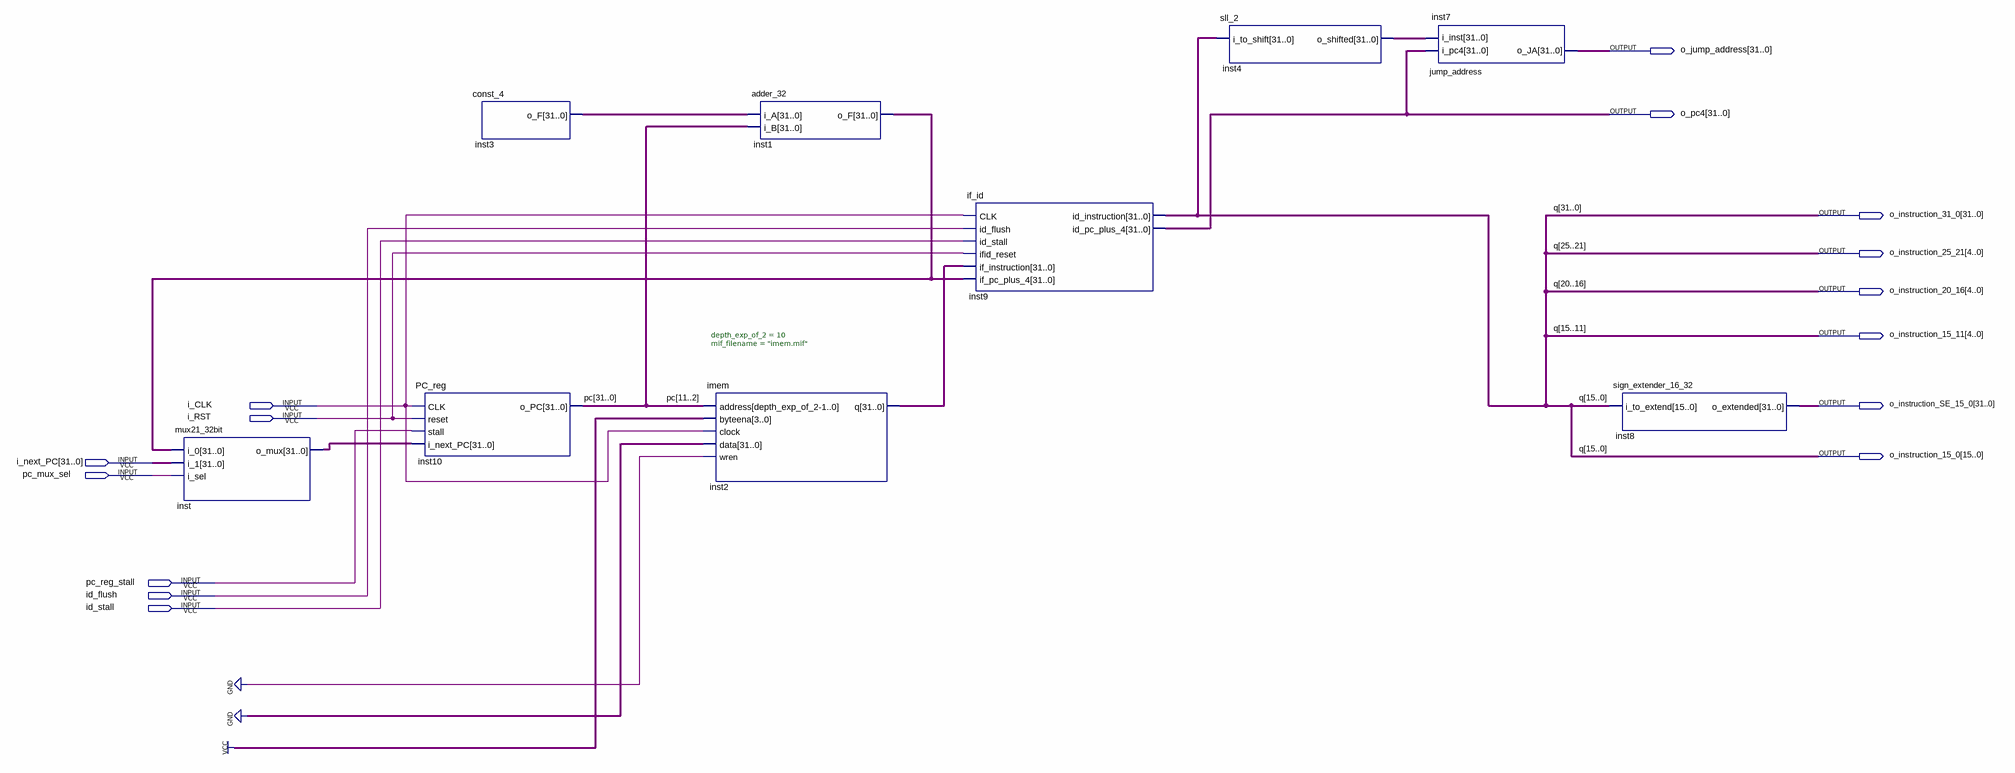
[diagram p0: schematic sheet]
// Quartus schematic instruction_pipe.bdf as structural Verilog: 9 symbols, 15 pins
module instruction_pipe (
  input  i_CLK,
  input  i_RST,
  input  [31:0] i_next_PC,
  input  pc_mux_sel,
  input  pc_reg_stall,
  input  id_flush,
  input  id_stall,
  output [31:0] o_jump_address,
  output [31:0] o_pc4,
  output [31:0] o_instruction_31_0,
  output [4:0] o_instruction_25_21,
  output [4:0] o_instruction_20_16,
  output [4:0] o_instruction_15_11,
  output [31:0] o_instruction_SE_15_0,
  output [15:0] o_instruction_15_0
);

  wire [31:0] inst1_o_f, inst2_q, inst3_o_f, inst4_o_shifted, inst_o_mux, pc;

  mux21_32bit inst (.i_0(inst1_o_f), .i_1(i_next_PC), .i_sel(pc_mux_sel), .o_mux(inst_o_mux));
  PC_reg inst10 (.CLK(i_CLK), .reset(i_RST), .stall(pc_reg_stall), .i_next_PC(inst_o_mux), .o_PC(pc));
  const_4 inst3 (.o_F(inst3_o_f));
  adder_32 inst1 (.i_A(inst3_o_f), .i_B(pc), .o_F(inst1_o_f));
  imem #(.depth_exp_of_2(10), .mif_filename("imem.mif")) inst2 (
    .address(pc[11:2]), .byteena(4'b1111), .clock(i_CLK), .data({32{1'b0}}), .wren(1'b0), .q(inst2_q));
  if_id inst9 (
    .CLK(i_CLK), .id_flush(id_flush), .id_stall(id_stall), .ifid_reset(i_RST), .if_instruction(inst2_q),
    .if_pc_plus_4(inst1_o_f),
    .id_instruction({o_instruction_31_0[31:26], o_instruction_25_21, o_instruction_20_16, o_instruction_15_0}),
    .id_pc_plus_4(o_pc4));
  sll_2 inst4 (
    .i_to_shift({o_instruction_31_0[31:26], o_instruction_25_21, o_instruction_20_16, o_instruction_15_0}),
    .o_shifted(inst4_o_shifted));
  jump_address inst7 (.i_pc4(o_pc4), .i_inst(inst4_o_shifted), .o_JA(o_jump_address));
  sign_extender_16_32 inst8 (.i_to_extend(o_instruction_15_0), .o_extended(o_instruction_SE_15_0));

  assign o_instruction_15_11 = o_instruction_15_0[15:11];
  assign o_instruction_31_0[25:0] = {o_instruction_25_21, o_instruction_20_16, o_instruction_15_0};

  // Other names for the same wires on the sheet: q[31:0] = {o_instruction_31_0[31:26], o_instruction_25_21, o_instruction_20_16, o_instruction_15_0}
endmodule
